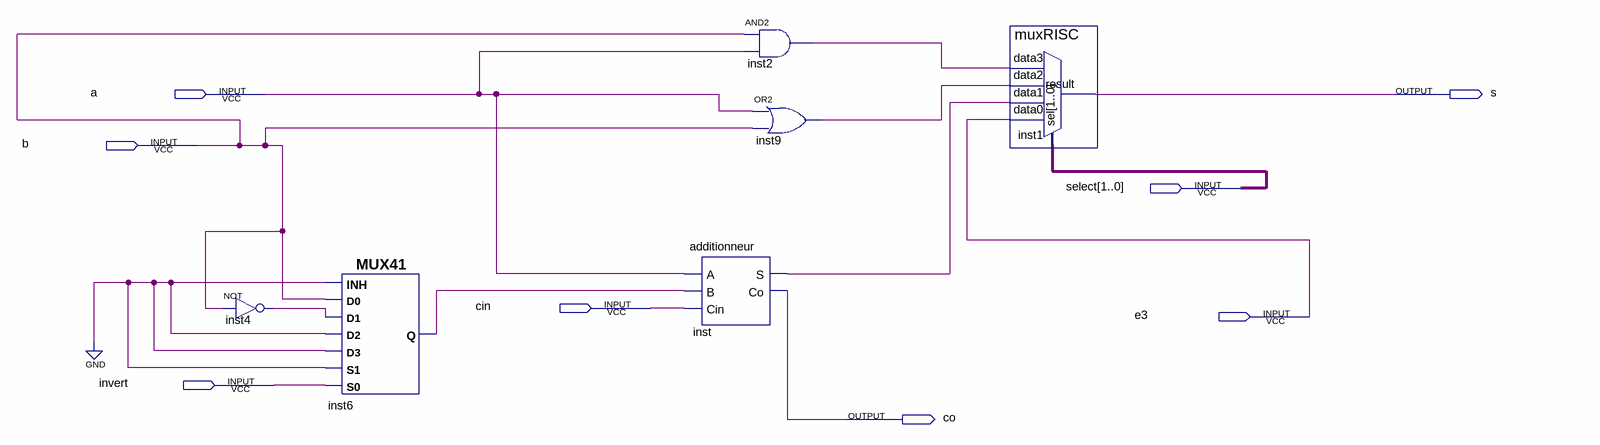
[diagram p0: schematic sheet]
// Quartus schematic risc.bdf as structural Verilog: 6 symbols, 8 pins
module risc (
  input  a,
  input  b,
  input  [1:0] select,
  input  cin,
  input  e3,
  input  invert,
  output s,
  output co
);

  wire inst2_out, inst4_out, inst6_q, inst9_out, inst_s;

  not inst4 (inst4_out, b);
  MUX41 inst6 (.S0(invert), .D2(1'b0), .S1(1'b0), .D3(1'b0), .D0(b), .INH(1'b0), .D1(inst4_out), .Q(inst6_q));
  additionneur inst (.A(a), .B(inst6_q), .Cin(cin), .S(inst_s), .Co(co));
  and inst2 (inst2_out, b, a);
  or inst9 (inst9_out, a, b);
  muxRISC inst1 (.data3(inst2_out), .data2(inst9_out), .data1(inst_s), .data0(e3), .sel(select), .result(s));
endmodule
